# Altium schematic sheet connector-top-j4-0.SchDoc: Connector - J4(Top) 0
size Letter; CompanyName: Brinton Engineering, LLC; Address1: 3479 Edison Way; Address2: Menlo Park CA 94025; Address3: +1 (877) 778-8435; Address4: brintonengineering.com; Revision: 1; SheetNumber: 1; SheetTotal: 1
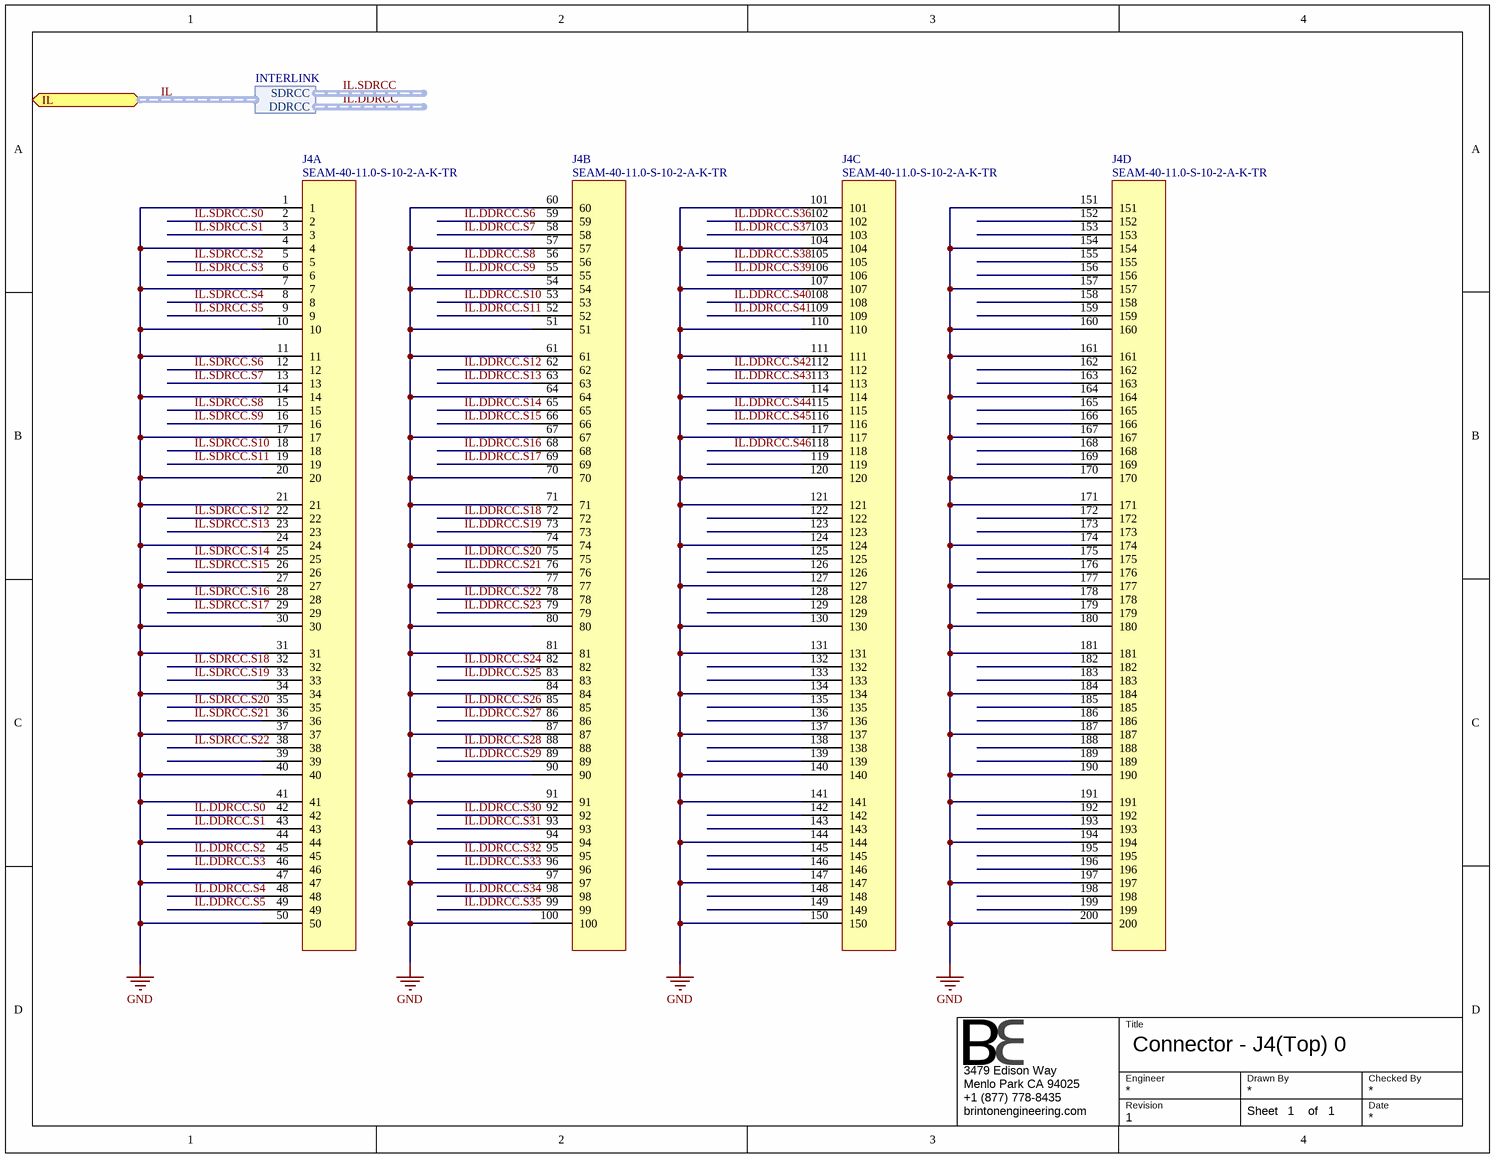
[diagram p0: connector-top-j4-0.SchDoc]

## Parts
J4  SEAM-40-11.0-S-10-2-A-K-TR  [SEAM-40-11.0-S-10-2-A-K-TR]  (parts A,B,C,D of 8)

## Ports
IL (harness INTERLINK)

## Harnesses
INTERLINK: DDRCC, SDRCC

## Nets
GND: J4.1 J4.4 J4.7 J4.10 J4.11 J4.14 J4.17 J4.20 J4.21 J4.24 J4.27 J4.30 J4.31 J4.34 J4.37 J4.40 J4.41 J4.44 J4.47 J4.50 J4.51 J4.54 J4.57 J4.60 J4.61 J4.64 J4.67 J4.70 J4.71 J4.74 J4.77 J4.80 J4.81 J4.84 J4.87 J4.90 J4.91 J4.94 J4.97 J4.100 J4.101 J4.104 J4.107 J4.110 J4.111 J4.114 J4.117 J4.120 J4.121 J4.124 J4.127 J4.130 J4.131 J4.134 J4.137 J4.140 J4.141 J4.144 J4.147 J4.150 J4.151 J4.154 J4.157 J4.160 J4.161 J4.164 J4.167 J4.170 J4.171 J4.174 J4.177 J4.180 J4.181 J4.184 J4.187 J4.190 J4.191 J4.194 J4.197 J4.200
IL.DDRCC.S0: J4.42
IL.DDRCC.S1: J4.43
IL.DDRCC.S2: J4.45
IL.DDRCC.S3: J4.46
IL.DDRCC.S4: J4.48
IL.DDRCC.S5: J4.49
IL.DDRCC.S6: J4.59
IL.DDRCC.S7: J4.58
IL.DDRCC.S8: J4.56
IL.DDRCC.S9: J4.55
IL.DDRCC.S10: J4.53
IL.DDRCC.S11: J4.52
IL.DDRCC.S12: J4.62
IL.DDRCC.S13: J4.63
IL.DDRCC.S14: J4.65
IL.DDRCC.S15: J4.66
IL.DDRCC.S16: J4.68
IL.DDRCC.S17: J4.69
IL.DDRCC.S18: J4.72
IL.DDRCC.S19: J4.73
IL.DDRCC.S20: J4.75
IL.DDRCC.S21: J4.76
IL.DDRCC.S22: J4.78
IL.DDRCC.S23: J4.79
IL.DDRCC.S24: J4.82
IL.DDRCC.S25: J4.83
IL.DDRCC.S26: J4.85
IL.DDRCC.S27: J4.86
IL.DDRCC.S28: J4.88
IL.DDRCC.S29: J4.89
IL.DDRCC.S30: J4.92
IL.DDRCC.S31: J4.93
IL.DDRCC.S32: J4.95
IL.DDRCC.S33: J4.96
IL.DDRCC.S34: J4.98
IL.DDRCC.S35: J4.99
IL.DDRCC.S36: J4.102
IL.DDRCC.S37: J4.103
IL.DDRCC.S38: J4.105
IL.DDRCC.S39: J4.106
IL.DDRCC.S40: J4.108
IL.DDRCC.S41: J4.109
IL.DDRCC.S42: J4.112
IL.DDRCC.S43: J4.113
IL.DDRCC.S44: J4.115
IL.DDRCC.S45: J4.116
IL.DDRCC.S46: J4.118
IL.SDRCC.S0: J4.2
IL.SDRCC.S1: J4.3
IL.SDRCC.S2: J4.5
IL.SDRCC.S3: J4.6
IL.SDRCC.S4: J4.8
IL.SDRCC.S5: J4.9
IL.SDRCC.S6: J4.12
IL.SDRCC.S7: J4.13
IL.SDRCC.S8: J4.15
IL.SDRCC.S9: J4.16
IL.SDRCC.S10: J4.18
IL.SDRCC.S11: J4.19
IL.SDRCC.S12: J4.22
IL.SDRCC.S13: J4.23
IL.SDRCC.S14: J4.25
IL.SDRCC.S15: J4.26
IL.SDRCC.S16: J4.28
IL.SDRCC.S17: J4.29
IL.SDRCC.S18: J4.32
IL.SDRCC.S19: J4.33
IL.SDRCC.S20: J4.35
IL.SDRCC.S21: J4.36
IL.SDRCC.S22: J4.38

Not connected (* = marked no-connect by the designer): J4 39 119 122 123 125 126 128 129 132 133 135 136 138 139 142 143 145 146 148 149 152 153 155 156 158 159 162 163 165 166 168 169 172 173 175 176 178 179 182 183 185 186 188 189 192 193 195 196 198 199

## Buses and harness runs
harness IL = port IL

## Notes on the sheet
- Title
- Engineer
- Revision
- Drawn By
- Checked By
- Date
- Sheet
- of

## Library data of the parts
J4 = SEAM-40-11.0-S-10-2-A-K-TR: Terminal Array Assembly, Surface Mount, 0.050" Pitch, 400 Pins; Manufacturer: Samtec; Manufacturer P/N: SEAM-40-11.0-S-10-2-A-K-TR